# EAGLE design BareBonesArduino (EAGLE 9.6.2)
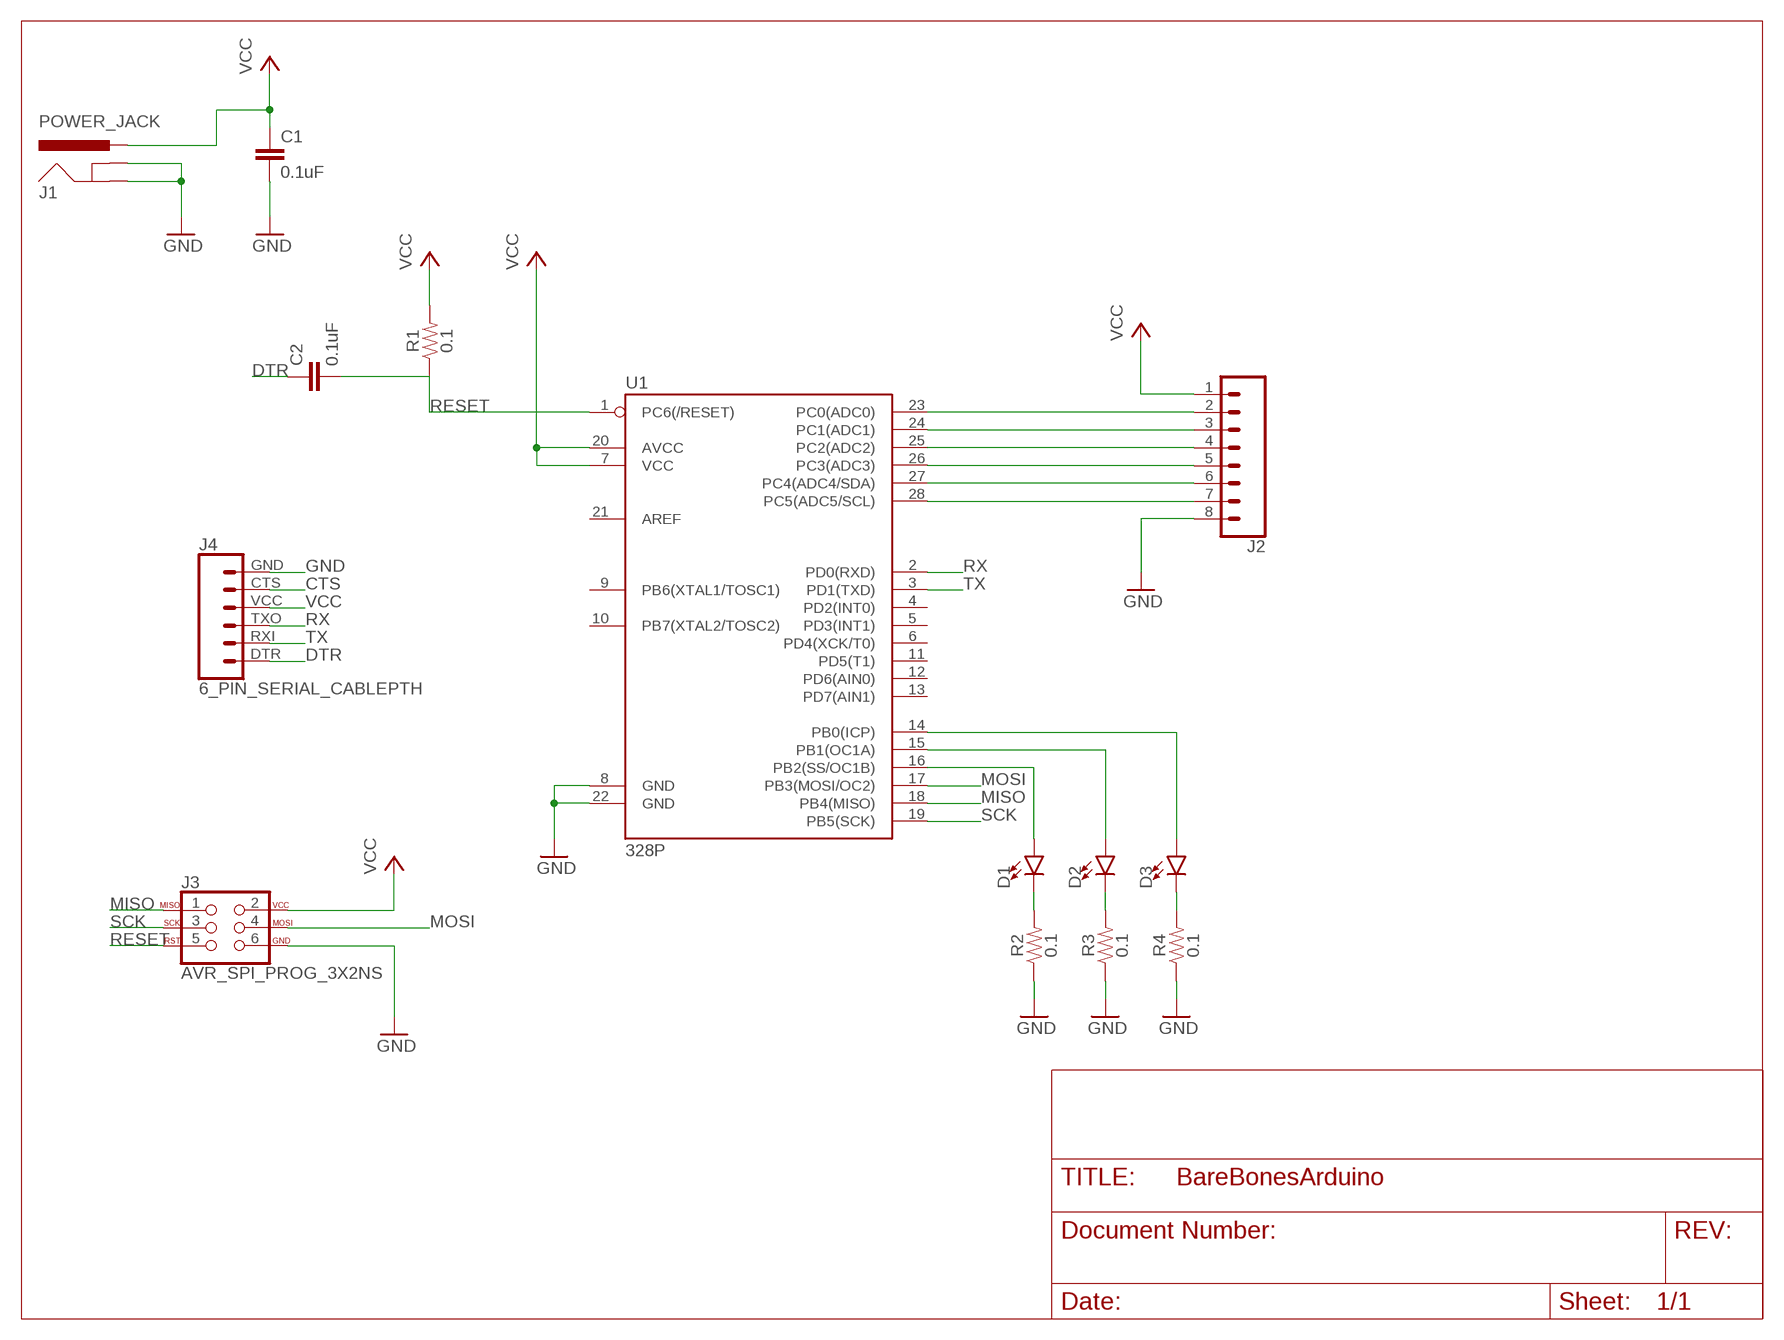
[diagram p0: schematic, sheet 1]

## Parts
C1  0.1uF  0.1UF-0402-16V-10%  [0402]
C2  0.1uF  0.1UF-0402-16V-10%  [0402]
D1  LED5MM  [LED_5MM]
D2  LED5MM  [LED_5MM]
D3  LED5MM  [LED_5MM]
J1  POWER_JACK  [POWER_JACK_PTH]
J2  CONN_08"  [1X08]
J3  AVR_SPI_PROG_3X2NS  [2X3-NS]
J4  6_PIN_SERIAL_CABLEPTH  [FTDI_BASIC]
R1  0.1  0.1OHM-1210-1/2W-1%  [1210]
R2  0.1  0.1OHM-1210-1/2W-1%  [1210]
R3  0.1  0.1OHM-1210-1/2W-1%  [1210]
R4  0.1  0.1OHM-1210-1/2W-1%  [1210]
U1  328P  ATMEGA328P_PDIP  [DIP28]

## Nets
CTS: J4.CTS
DTR: C2.1 J4.DTR
GND: C1.2 J1.GND J1.GNDBREAK J2.8 J3.6 J4.GND R2.1 R3.1 R4.1 U1.8(GND) U1.22(GND)
MISO: J3.1 U1.18(PB4(MISO))
MOSI: J3.4 U1.17(PB3(MOSI/OC2))
N$3: D1.A U1.16(PB2(SS/OC1B))
N$4: D2.A U1.15(PB1(OC1A))
N$5: D3.A U1.14(PB0(ICP))
N$6: D3.K(C) R4.2
N$7: D1.K(C) R2.2
N$8: D2.K(C) R3.2
N$9: J2.7 U1.28(PC5(ADC5/SCL))
N$10: J2.6 U1.27(PC4(ADC4/SDA))
N$11: J2.5 U1.26(PC3(ADC3))
N$12: J2.4 U1.25(PC2(ADC2))
N$13: J2.3 U1.24(PC1(ADC1))
N$14: J2.2 U1.23(PC0(ADC0))
RESET: C2.2 J3.5 R1.1 U1.1(PC6(/RESET))
RX: J4.TXO U1.2(PD0(RXD))
SCK: J3.3 U1.19(PB5(SCK))
TX: J4.RXI U1.3(PD1(TXD))
VCC: C1.1 J1.PWR J2.1 J3.2 J4.VCC R1.2 U1.7(VCC) U1.20(AVCC)
Unconnected: U1.4(PD2(INT0)) U1.5(PD3(INT1)) U1.6(PD4(XCK/T0)) U1.9(PB6(XTAL1/TOSC1)) U1.10(PB7(XTAL2/TOSC2)) U1.11(PD5(T1)) U1.12(PD6(AIN0)) U1.13(PD7(AIN1)) U1.21(AREF)

## Library data of the parts
C1 C2 = SparkFun-Capacitors:0.1UF: 0.1µF ceramic capacitors A capacitor is a passive two-terminal electrical component used to store electrical energy temporarily in an electric field.; PROD_ID: CAP-12416
D1-D3 = SparkFun-LED:LED: LED (Generic) Standard schematic elements and footprints for 5mm, 3mm, 1206, and 0603 sized LEDs. Generic LEDs with no color specified.
J1 = SparkFun-Connectors:POWER_JACK: Power Jack Connector This is the standard 5.5mm barrel jack for power. The PTH is the most common, proven, reliable, footprint. The Slot footprint only works if the mill layer is transmitted to the PCB fab house so be warned. Here are the connectors we sell at SparkFun: DC Barrel Power Jack/Connector <https://www.sparkfun.com/products/119> (PRT-00119) DC Barrel Power Jack/Connector (SMD) <https://www.sparkfun.com/products/12748> (PRT-12748) DC Barrel Jack Adapter - Breadboard Compatible <https://www.sparkfun.com/products/10811> (PRT-10811) It is used on this SparkFun product (and many, many others): SparkFun RedBoard - Programmed with Arduino <https://www.sparkfun.com/products/12757> (DEV-12757) Also, if you need a mating power supply or connector, please check these out: Wall Adapter Power Supply - 9VDC 650mA <https://www.sparkfun.com/products/298> (TOL-00298) DC Barrel Jack Adapter - Male <https://www.sparkfun.com/products/10287> (PRT-10287); PROD_ID: CONN-08197
J2 = SparkFun-Connectors:CONN_08: Multi connection point. Often used as Generic Header-pin footprint for 0.1 inch spaced/style header connections On any of the 0.1 inch spaced packages, you can populate with these: Break Away Headers - Straight <https://www.sparkfun.com/products/116> (PRT-00116) Break Away Male Headers - Right Angle <https://www.sparkfun.com/products/553> (PRT-00553) Female Headers <https://www.sparkfun.com/products/115> (PRT-00115) Break Away Headers - Machine Pin <https://www.sparkfun.com/products/117> (PRT-00117) Break Away Female Headers - Swiss Machine Pin <https://www.sparkfun.com/products/743> (PRT-00743) Arduino Stackable Header - 8 Pin <https://www.sparkfun.com/products/9279> (PRT-09279) For SCREWTERMINALS and SPRING TERMINALS visit here: Screw Terimnals on SparkFun.com <https://www.sparkfun.com/search/results?term=Screw+Terminals> (5mm/3.5mm/2.54mm spacing) This device is also useful as a general connection point to wire up your design to another part of your project. Our various solder wires solder well into these plated through hole pads. Hook-Up Wire - Assortment (Stranded, 22 AWG) <https://www.sparkfun.com/products/11375> (PRT-11375) Hook-Up Wire - Assortment (Solid Core, 22 AWG) <https://www.sparkfun.com/products/11367> (PRT-11367) View the entire wire category on our website here <https://www.sparkfun.com/categories/141> Special notes: Molex polarized connector foot print use with SKU : PRT-08231 with associated crimp pins and housings. 1MM SMD Version SKU: PRT-10208 NOTES ON THE VARIANTS LOCK and LOCK_LONGPADS... This footprint was designed to help hold the alignment of a through-hole component (i.e. 6-pin header) while soldering it into place. You may notice that each hole has been shifted either up or down by 0.005 of an inch from it's more standard position (which is a perfectly straight line). This slight alteration caused the pins (the squares in the middle) to touch the edges of the holes. Because they are alternating, it causes a "brace" to hold the component in place. 0.005 has proven to be the perfect amount of "off-center" position when using our standard breakaway headers. Although looks a little odd when you look at the bare footprint, once you have a header in there, the alteration is very hard to notice. Also,if you push a header all the way into place, it is covered up entirely on the bottom side.; PROD_ID: CONN-08438
J3 = SparkFun-Connectors:AVR_SPI_PROG_3X2: AVR ISP 6 Pin This is the reduced ISP connector for AVR programming. Common on Arduino. This footprint will take up less PCB space and can be used with a 10-pin to 6-pin adapter such as SKU: BOB-08508 **Special note about "TEST_POINT" package. The stop mask is on the top side, so if you want your programming test points to be on the bottom of your board, make sure to place this package on the bottom side of the board. This also ensure that the orientation to program from the bottom side will be correct. SparkFun Products: SparkFun ISP Pogo Adapter <https://www.sparkfun.com/products/11591> - NS Tiny AVR Programmer <https://www.sparkfun.com/products/11801> -PTH
J4 = SparkFun-Connectors:6_PIN_SERIAL_CABLE: 6-pin header connection for use with the "FTDI BASIC" pinout - CABLE SIDE. Also known as "Arduino Serial Program Header". This is used on a design to provide a 6-pin connection point for serial communication usually from a USB cable (D+/D-) to these headers (RX/TX). It also has the remaining pins necessary for programming in the Arduino evironment (DTR, GND, and sometimes VCC). Note, this device has "CABLE" in the name. It is intended to be used on a design that usually lives on the end of your USB cable and prvides the converter chip (FTDI232 or FTDI231x) to commnicate serial RX/TX. The "sister" device, named "TARGET" is inteneded to be used on a design that contains a target micro-controller that you wish to program. You can populate with some of these: Female Headers <https://www.sparkfun.com/products/115> (PRT-00115) For reference (or to suit your programming needs) check out these designs: SparkFun FTDI Basic Breakout - 5V <https://www.sparkfun.com/products/9716> (DEV-09716) SparkFun FTDI Basic Breakout - 3.3V <https://www.sparkfun.com/products/9873> (DEV-09873) SparkFun FTDI SmartBasic <https://www.sparkfun.com/products/12935> (DEV-12935) SparkFun Beefy 3 - FTDI Basic Breakout <https://www.sparkfun.com/products/13746> (DEV-13746)
R1-R4 = SparkFun-Resistors:0.1OHM: 0.1Ω resistor A resistor is a passive two-terminal electrical component that implements electrical resistance as a circuit element. Resistors act to reduce current flow, and, at the same time, act to lower voltage levels within circuits. - Wikipedia; PROD_ID: RES-12374
U1 = SparkFun-IC-Microcontroller:ATMEGA328P_PDIP: Atmel 328P Through hole ATMEGA328P uC used in the Arduino 32kb flash, 1k EEPROM, 2k SRAM Datasheet <http://www.sparkfun.com/datasheets/Components/SMD/ATMega328.pdf> SparkFun Products Storefront component: AVR 28 Pin 20MHz 32K 6A/D - ATMega328P <https://www.sparkfun.com/products/9061> (COM-09061) SparkFun Simon Says - Through-Hole Soldering Kit <https://www.sparkfun.com/products/10547> (KIT-10547) SparkFun Learn to Solder - Simon Says <https://www.sparkfun.com/products/13708> (KIT-13708) SparkFun BigTime Watch Kit <https://www.sparkfun.com/products/11734> (KIT-11734) SparkFun ClockIt <https://www.sparkfun.com/products/10930> (KIT-10930) SparkFun Serial Enabled LCD Kit <https://www.sparkfun.com/products/10097> (LCD-10097) SparkFun Simon Tilts - Through Hole Soldering Kit <https://www.sparkfun.com/products/12634> (KIT-12634) SparkFun Frequency Counter Kit <https://www.sparkfun.com/products/10140> (KIT-10140) FabFM Radio Kit <https://www.sparkfun.com/products/11043> (KIT-11043) SparkFun Binary Blaster Kit <https://www.sparkfun.com/products/12037> (KIT-12037) SparkFun Metro-Gnome <https://www.sparkfun.com/products/9236> (KIT-09236) ATmega328 with Arduino Optiboot (Uno) <https://www.sparkfun.com/products/10524> (DEV-10524); PROD_ID: IC-09136

## Board
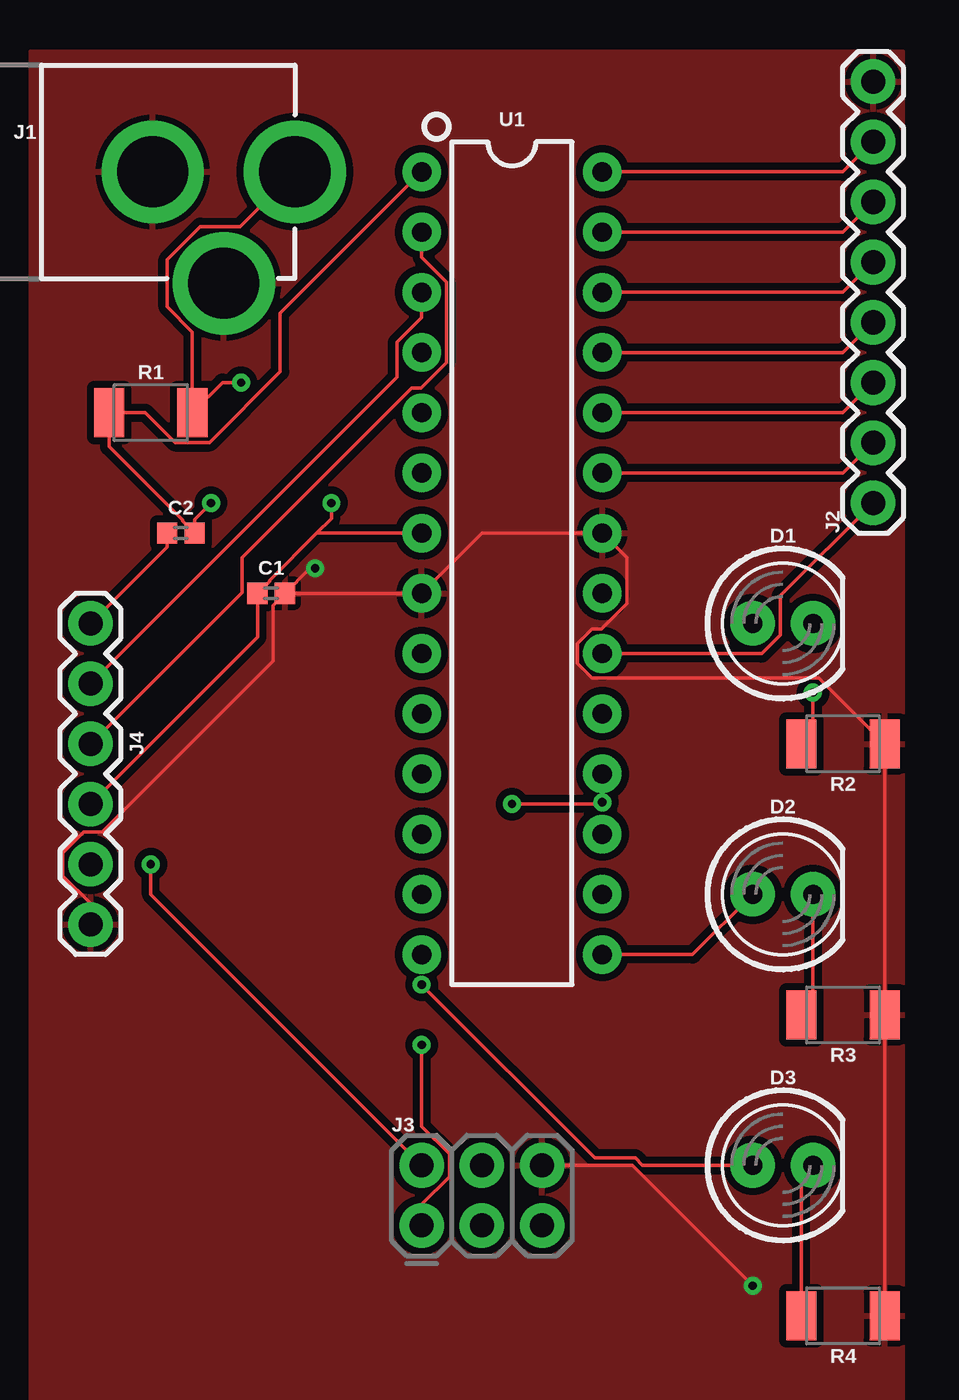
[diagram p1: board, top side]
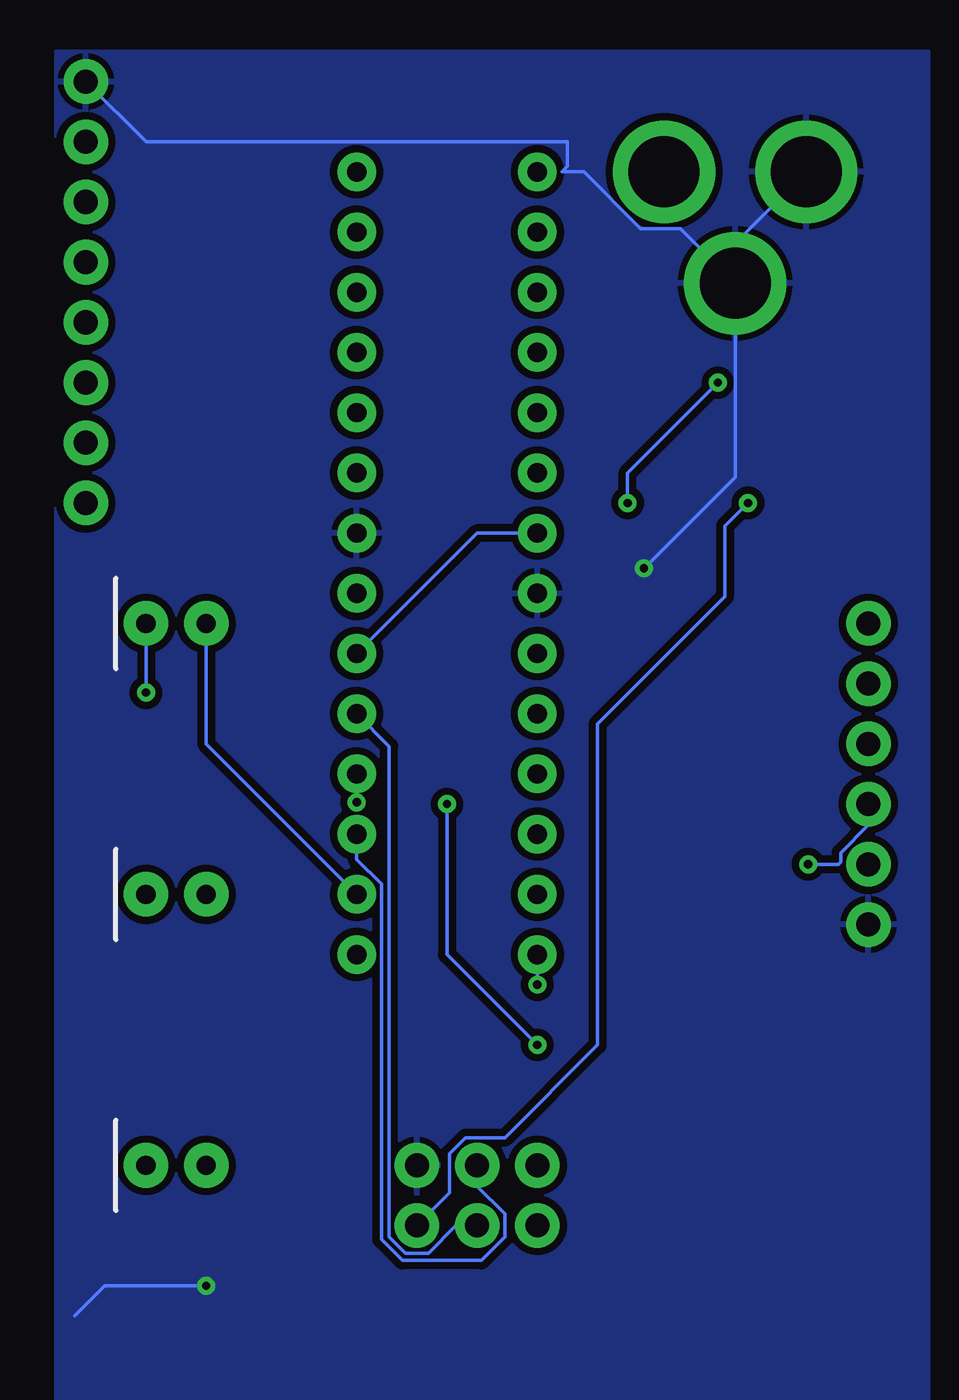
[diagram p2: board, bottom side, seen from below]

No outline drawn. Coordinates in mm, seen from the top.
Copper layers (1*16): Top 0.035mm / dielectric 1.5mm / Bottom 0.035mm
Design rules "default": minimum track width 6mil, minimum drill 0.35mm, track to track 6mil, track to pad 6mil, pad to pad 6mil, via to via 6mil, smd to smd 6mil, copper to edge 40mil, drill to drill 6mil, minimum pad ring 10mil, minimum via ring 8mil, stop-mask expansion 4mil, vias tented up to drill 0mil, thermal gap 10mil

### Footprints (pad centres in the part's own frame; a part is rotated, then mirrored left to right if it is on the bottom)
0402 = smd 0.85 x 0.9: 1 -0.58,0; 2 0.58,0
LED_5MM = drill 0.813 pad 1.88: A -1.27,0; K 1.27,0
POWER_JACK_PTH = drill 2.997 pad 4.318: GND 0,7.7; GNDBREAK 4.7,10.7; PWR 0,13.7
1X08 = drill 1.016 pad 1.88: 1 0,0; 2 2.54,0; 3 5.08,0; 4 7.62,0; 5 10.16,0; 6 12.7,0; 7 15.24,0; 8 17.78,0
2X3-NS = drill 1.016 pad 1.88: 1 -2.54,-1.27; 2 -2.54,1.27; 3 0,-1.27; 4 0,1.27; 5 2.54,-1.27; 6 2.54,1.27
FTDI_BASIC = drill 1.016 pad 1.88: CTS 10.16,0; DTR 0,0; GND 12.7,0; RXI 2.54,0; TXO 5.08,0; VCC 7.62,0
1210 = smd 1.27 x 2.06: 1 -1.755,0; 2 1.755,0
DIP28 = drill 0.813 pad 1.626: 1 -16.51,-3.81; 2 -13.97,-3.81; 3 -11.43,-3.81; 4 -8.89,-3.81; 5 -6.35,-3.81; 6 -3.81,-3.81; 7 -1.27,-3.81; 8 1.27,-3.81; 9 3.81,-3.81; 10 6.35,-3.81; 11 8.89,-3.81; 12 11.43,-3.81; 13 13.97,-3.81; 14 16.51,-3.81; 15 16.51,3.81; 16 13.97,3.81; 17 11.43,3.81; 18 8.89,3.81; 19 6.35,3.81; 20 3.81,3.81; 21 1.27,3.81; 22 -1.27,3.81; 23 -3.81,3.81; 24 -6.35,3.81; 25 -8.89,3.81; 26 -11.43,3.81; 27 -13.97,3.81; 28 -16.51,3.81

### Placement (x,y rotation side)
C1  10.16,34.29 0 top
C2  6.35,36.83 0 top
D1  31.75,33.02 0 top
D2  31.75,21.59 0 top
D3  31.75,10.16 0 top
J1  -2.54,52.07 270 top
J2  35.56,38.1 90 top
J3  19.05,8.89 0 top
J4  2.54,33.02 270 top
R1  5.08,41.91 0 top
R2  34.29,27.94 180 top
R3  34.29,16.51 180 top
R4  34.29,3.81 180 top
U1  20.32,35.56 270 top

### Tracks (layer width: path | path; a pad name or v marks a point on that pad's centre or on a via)
DTR
  Top 0.152: J4.DTR 5.77,36.25 C2.1
GND  (via drill 0.35)
  Top 0.152: C1.2 10.23,33.78 10.23,31.44 3.02,24.23 2.26,24.23 1.37,23.34 1.37,22.38 2.54,21.21 J4.GND | C1.2 U1.8 19.05,36.83 U1.22 25.17,35.79 25.17,33.86 24.1,32.79 23.7,32.79 23.09,32.18 23.09,31.32 23.7,30.71 33.28,30.71 R2.1 R3.1 R4.1 | J3.6 25.4,10.16 v30.48,5.08 | C1.2 11.77,35.32 12.01,35.32 v12.01,35.34
  Bottom 0.152: J1.GND 8.16,49.07 J1.GNDBREAK | J1.GNDBREAK 10.47,49.68 12.15,49.68 14.54,52.07 15.47,52.07 15.24,52.3 15.24,53.34 33.02,53.34 J2.8 | v30.48,5.08 34.76,5.08 36.03,3.81 | v12.01,35.34 8.16,39.2 J1.GNDBREAK
  pour Bottom (isolate 0.305): 0,0 36.83,0 36.83,57.15 0,57.15
  pour Top (isolate 0.305): 0,0 36.83,0 36.83,57.15 0,57.15
MISO  (via drill 0.35)
  Top 0.152: v24.13,25.47 24.06,25.4 v20.32,25.4 | v16.51,15.24 16.51,11.81 17.68,10.64 17.68,9.68 16.51,8.51 J3.1
  Bottom 0.152: U1.18 v24.13,25.47 24.13,25.4 | v20.32,25.4 20.32,19.05 v16.51,15.24
MOSI
  Bottom 0.152: U1.17 24.13,23.06 23.09,22.02 23.09,7.04 22.2,6.15 18.87,6.15 17.88,7.14 17.88,8.1 19.05,9.27 J3.4
N$3
  Bottom 0.152: D1.A 30.48,27.94 U1.16
N$4
  Top 0.152: D2.A 27.94,19.05 U1.15
N$5  (via drill 0.35)
  Top 0.152: v16.51,17.78 23.82,10.46 25.53,10.46 25.83,10.16 D3.A
  Bottom 0.152: U1.14 v16.51,17.78
N$6
  Top 0.152: R4.2 32.53,9.68 D3.K
N$7  (via drill 0.35)
  Top 0.152: v33.02,30.1 33.02,28.43 R2.2
  Bottom 0.152: D1.K v33.02,30.1
N$8
  Top 0.152: R3.2 32.78,16.75 33.02,17 D2.K
N$9
  Top 0.152: J2.7 34.29,52.07 U1.28
N$10
  Top 0.152: J2.6 34.29,49.53 U1.27
N$11
  Top 0.152: J2.5 34.29,46.99 U1.26
N$12
  Top 0.152: J2.4 34.29,44.45 U1.25
N$13
  Top 0.152: J2.3 34.29,41.91 U1.24
N$14
  Top 0.152: J2.2 34.29,39.37 U1.23
RESET  (via drill 0.35)
  Top 0.152: U1.1 10.55,46.11 10.55,43.63 7.57,40.65 6.11,40.65 4.85,41.91 R1.1 3.33,40.47 6.42,37.38 6.42,37.34 C2.2 6.93,37.41 v7.62,38.1
  Bottom 0.152: v7.62,38.1 8.59,37.13 8.59,34.16 13.97,28.78 13.97,15.24 17.88,11.33 19.53,11.33 20.22,10.64 20.22,8.99 J3.5
  other vias: 16.51,52.07
RX
  Top 0.152: J4.TXO 8.93,34.33 8.93,35.8 16.08,42.95 16.48,42.95 17.55,44.02 17.55,47.42 16.51,48.46 U1.2
SCK
  Bottom 0.152: U1.19 22.76,27.84 22.76,7.14 22.07,6.45 21.11,6.45 19.94,7.62 J3.3
TX
  Top 0.152: J4.RXI 15.47,43.41 15.47,44.88 16.51,45.92 U1.3
VCC  (via drill 0.35)
  Top 0.152: J2.1 31.65,34.19 31.65,32.54 30.86,31.75 U1.20 | J4.VCC 9.58,32.44 C1.1 | J1.PWR 8.85,49.76 7.17,49.76 5.77,48.36 5.77,46.38 6.83,45.32 R1.2 8.11,43.18 v8.89,43.18 | C1.1 9.58,34.33 | 12.08,36.83 U1.7 | C1.1 10.09,34.8 10.09,34.84 12.08,36.83 | 12.08,36.83 12.7,37.45 v12.7,38.1 | J3.2 5.08,21.59 v5.08,22.86
  Bottom 0.152: J4.VCC 2.54,24.51 3.71,23.34 3.71,22.96 3.81,22.86 v5.08,22.86 | U1.7 19.05,36.83 U1.20 | 9.59,42.48 v8.89,43.18 12.7,39.37 v12.7,38.1